# Altium project SSB25_rev0.PrjPCB
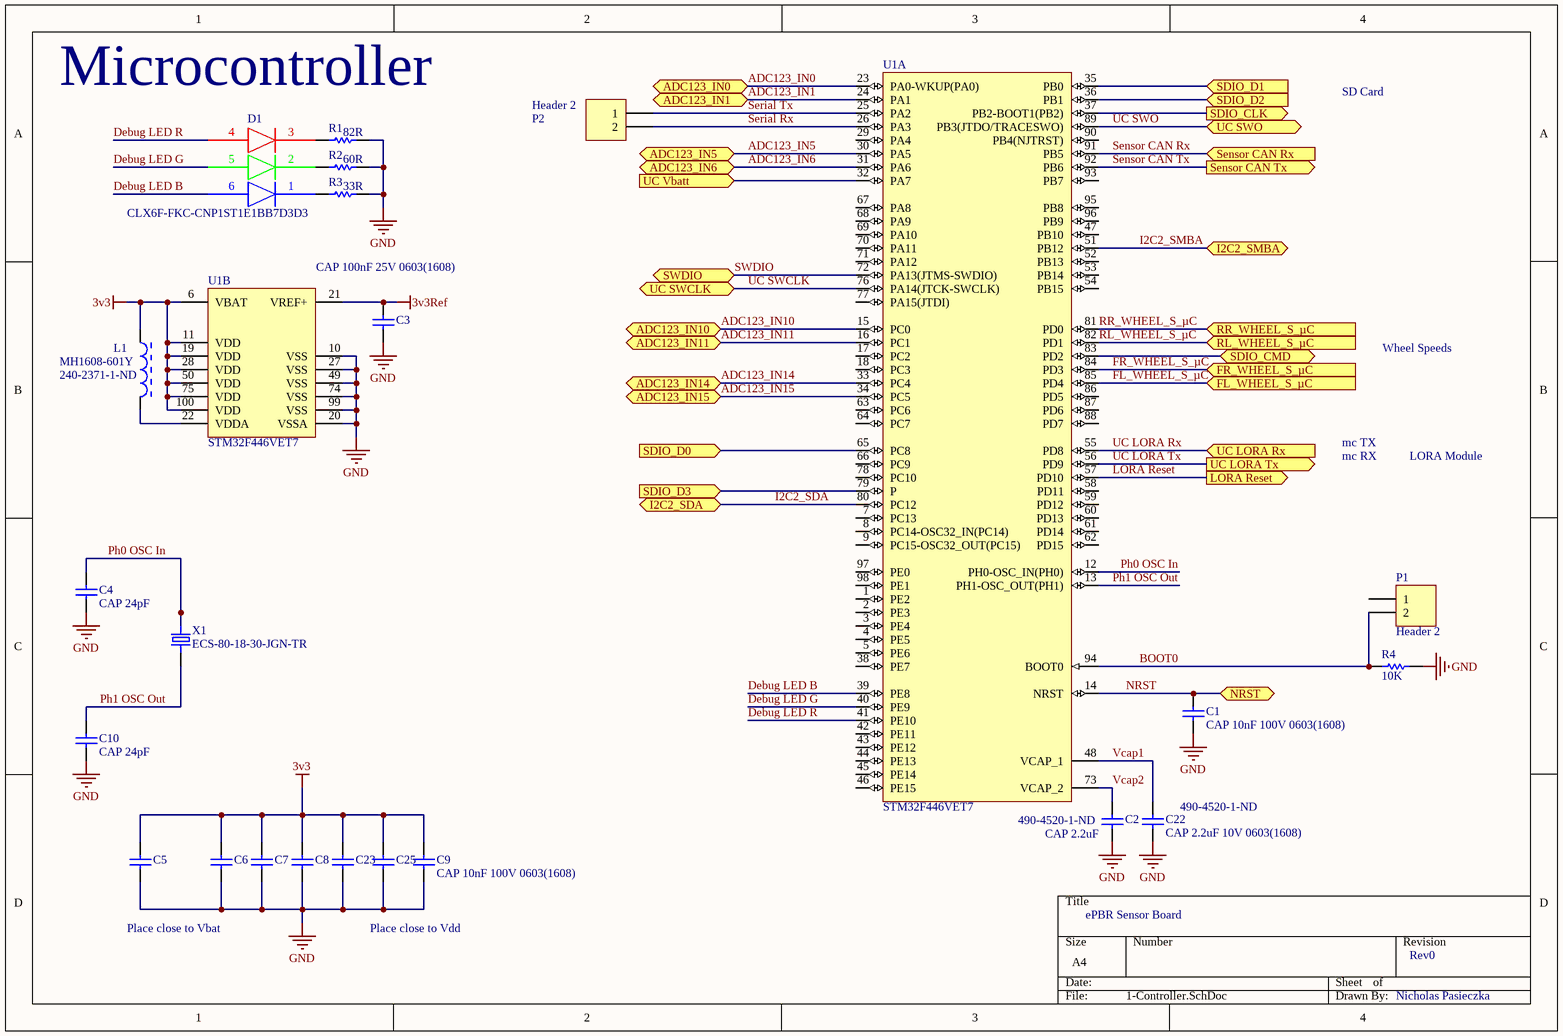
[diagram p0: 1-Controller.SchDoc]
4 sheets, 59 parts. Net scope: flat (ports and power ports of the same name join across sheets).
Board file: SSB25_rev0.PcbDoc
Sheets:
  1-Controller.SchDoc
  3-CAN.SchDoc
  4-Connector.SchDoc
  6-Sensors.SchDoc

## Sheet 1-Controller.SchDoc
size A4

### Parts
C1  CAP 10nF 100V 0603(1608)  [CAPC0603(1608)100_M]
C2  CAP 2.2uF  Supplier Part Number 1: 490-4520-1-ND  [CAPC0603(1608)55_N]
C3  CAP 100nF 25V 0603(1608)  [CAPC0603(1608)100_N]
C4  CAP 24pF  [CAPC0603(1608)100_N]
C5  CAP 10nF 100V 0603(1608)  [CAPC0603(1608)100_M]  (value not drawn)
C6  CAP 10nF 100V 0603(1608)  [CAPC0603(1608)100_M]  (value not drawn)
C7  CAP 10nF 100V 0603(1608)  [CAPC0603(1608)100_M]  (value not drawn)
C8  CAP 10nF 100V 0603(1608)  [CAPC0603(1608)100_M]  (value not drawn)
C9  CAP 10nF 100V 0603(1608)  [CAPC0603(1608)100_M]
C10  CAP 24pF  [CAPC0603(1608)100_N]
C22  CAP 2.2uF 10V 0603(1608)  Supplier Part Number 1: 490-4520-1-ND  [CAPC0603(1608)55_N]
C23  CAP 10nF 100V 0603(1608)  [CAPC0603(1608)100_M]  (value not drawn)
C25  CAP 10nF 100V 0603(1608)  [CAPC0603(1608)100_M]  (value not drawn)
D1  CLX6F-FKC-CNP1ST1E1BB7D3D3  [CLX6C-FKB]
L1  MH1608-601Y  Supplier Part Number 1: 240-2371-1-ND  [BOUR-MH1608_V]
P1  Header 2  [HDR1X2]
P2  Header 2  [HDR1X2]
R1  82R  [RESC0603(1608)_N]
R2  60R  [RESC0603(1608)_N]
R3  33R  [RESC0603(1608)_N]
R4  10K  [RESC0603(1608)_N]
U1  STM32F446VET7  [STM-LQFP100_L]  (parts A,B of 2)
X1  ECS-80-18-30-JGN-TR  [XTAL_ECS-80-18-30-JGN-TR]

### Ports
ADC123_IN0 (bidir), ADC123_IN1 (bidir), ADC123_IN5 (bidir), ADC123_IN6 (bidir), ADC123_IN10 (bidir), ADC123_IN11 (bidir), ADC123_IN14 (bidir), ADC123_IN15 (bidir), FL_WHEEL_S_µC (in), FR_WHEEL_S_µC (in), I2C2_SDA (bidir), I2C2_SMBA (bidir), LORA Reset (out), NRST (bidir), RL_WHEEL_S_µC (in), RR_WHEEL_S_µC (in), SDIO_CLK (out), SDIO_CMD (bidir), SDIO_D0 (in), SDIO_D1 (in), SDIO_D2 (in), SDIO_D3 (in), Sensor CAN Rx (in), Sensor CAN Tx (out), SWDIO (bidir), UC LORA Rx (in), UC LORA Tx (out), UC SWCLK (bidir), UC SWO (bidir), UC Vbatt (in)

### Nets
3v3: C5.2 C6.2 C7.2 C8.2 C9.2 C23.2 C25.2 L1.1 U1.6(VBAT) U1.11(VDD) U1.19(VDD) U1.28(VDD) U1.50(VDD) U1.75(VDD) U1.100(VDD)
3v3Ref: C3.2 U1.21(VREF+)
GND: C1.1 C2.1 C3.1 C4.1 C5.1 C6.1 C7.1 C8.1 C9.1 C10.1 C22.1 C23.1 C25.1 R1.2 R2.2 R3.2 R4.2 U1.10(VSS) U1.20(VSSA) U1.27(VSS) U1.49(VSS) U1.74(VSS) U1.99(VSS)
ADC123_IN0: U1.23(PA0-WKUP(PA0)) ; port ADC123_IN0
ADC123_IN1: U1.24(PA1) ; port ADC123_IN1
ADC123_IN5: U1.30(PA5) ; port ADC123_IN5
ADC123_IN6: U1.31(PA6) ; port ADC123_IN6
ADC123_IN10: U1.15(PC0) ; port ADC123_IN10
ADC123_IN11: U1.16(PC1) ; port ADC123_IN11
ADC123_IN14: U1.33(PC4) ; port ADC123_IN14
ADC123_IN15: U1.34(PC5) ; port ADC123_IN15
BOOT0: P1.2 R4.1 U1.94(BOOT0)
Debug LED B: D1.6(B) U1.39(PE8)
Debug LED G: D1.5(G) U1.40(PE9)
Debug LED R: D1.4(R) U1.41(PE10)
FL_WHEEL_S_µC: U1.85(PD4) ; port FL_WHEEL_S_µC
FR_WHEEL_S_µC: U1.84(PD3) ; port FR_WHEEL_S_µC
I2C2_SDA: U1.80(PC12) ; port I2C2_SDA
I2C2_SMBA: U1.51(PB12) ; port I2C2_SMBA
LORA Reset: U1.57(PD10) ; port LORA Reset
NRST: C1.2 U1.14(NRST) ; port NRST
Ph0 OSC In: C4.2 U1.12(PH0-OSC_IN(PH0)) X1.2(OUT/IN)
Ph1 OSC Out: C10.2 U1.13(PH1-OSC_OUT(PH1)) X1.1(IN/OUT)
RL_WHEEL_S_µC: U1.82(PD1) ; port RL_WHEEL_S_µC
RR_WHEEL_S_µC: U1.81(PD0) ; port RR_WHEEL_S_µC
Sensor CAN Rx: U1.91(PB5) ; port Sensor CAN Rx
Sensor CAN Tx: U1.92(PB6) ; port Sensor CAN Tx
Serial Rx: P2.2 U1.26(PA3)
Serial Tx: P2.1 U1.25(PA2)
SWDIO: U1.72(PA13(JTMS-SWDIO)) ; port SWDIO
UC LORA Rx: U1.55(PD8) ; port UC LORA Rx
UC LORA Tx: U1.56(PD9) ; port UC LORA Tx
UC SWCLK: U1.76(PA14(JTCK-SWCLK)) ; port UC SWCLK
UC SWO: U1.89(PB3(JTDO/TRACESWO)) ; port UC SWO
Vcap1: C22.2 U1.48(VCAP_1)
Vcap2: C2.2 U1.73(VCAP_2)
NetCN1_1: U1.83(PD2) ; port SDIO_CMD
NetCN1_2: U1.79(P) ; port SDIO_D3
NetCN1_3: U1.65(PC8) ; port SDIO_D0
NetCN1_4: U1.35(PB0) ; port SDIO_D1
NetCN1_5: U1.36(PB1) ; port SDIO_D2
NetCN1_6: U1.37(PB2-BOOT1(PB2)) ; port SDIO_CLK
NetD1_1: D1.1(B) R3.1
NetD1_2: D1.2(G) R2.1
NetD1_3: D1.3(R) R1.1
NetL1_2: L1.2 U1.22(VDDA)
NetU1_32: U1.32(PA7) ; port UC Vbatt

Not connected (* = marked no-connect by the designer): P1 1; U1 1(PE2) 2(PE3) 3(PE4) 4(PE5) 5(PE6) 7(PC13) 8(PC14-OSC32_IN(PC14)) 9(PC15-OSC32_OUT(PC15)) 17(PC2) 18(PC3) 29(PA4) 38(PE7) 42(PE11) 43(PE12) 44(PE13) 45(PE14) 46(PE15) 47(PB10) 52(PB13) 53(PB14) 54(PB15) 58(PD11) 59(PD12) 60(PD13) 61(PD14) 62(PD15) 63(PC6) 64(PC7) 66(PC9) 67(PA8) 68(PA9) 69(PA10) 70(PA11) 71(PA12) 77(PA15(JTDI)) 78(PC10) 86(PD5) 87(PD6) 88(PD7) 90(PB4(NJTRST)) 93(PB7) 95(PB8) 96(PB9) 97(PE0) 98(PE1)

### Notes on the sheet
- Microcontroller
- SD Card
- Wheel Speeds
- mc TX
- mc RX
- LORA Module
- ePBR Sensor Board
- Place close to Vbat
- Place close to Vdd
- Rev0
- Nicholas Pasieczka

### Library data of the parts
C1 C5-C9 C23 C25 = CMP-1035-02326-1: CAP 10nF 100V ±20% 0603 (1608 Metric) Thickness 1mm SMD; Case-EIA: 0603; Tolerance: Â±20%; Case-Metric: 1608; Max Thickness: 1 mm; Technology: SMT; Value: 10nF; Rated Voltage: 100 V
C2 C22 = CMP-1035-02757-1: CAP 2.2uF 10V ±10% 0603 (1608 Metric) Thickness 0.55mm SMD; Case-EIA: 0603; Case-Metric: 1608; Tolerance: Â±10%; Value: 2.2uF; Rated Voltage: 10 V; Technology: SMT; Max Thickness: 0.55 mm; Supplier 1: Digi-Key
C3 = CMP-1035-02589-1: CAP 100nF 25V ±20% 0603 (1608 Metric) Thickness 1mm SMD; Case-EIA: 0603; Tolerance: Â±20%; Case-Metric: 1608; Value: 100nF; Max Thickness: 1 mm; Technology: SMT; Rated Voltage: 25 V
C4 C10 = CMP-1035-00843-1: CAP 24pF 16V ±2% 0603 (1608 Metric) Thickness 1mm SMD; Tolerance: Â±2%; Case-Metric: 1608; Case-EIA: 0603; Value: 24pF; Technology: SMT; Rated Voltage: 16 V; Max Thickness: 1 mm
D1 = LED - CLX6F-FKC-CNP1ST1E1BB7D3D3: Red, Green, Blue (RGB) 622nm Red, 530nm Green, 470nm Blue LED Indication - Discrete 2.1V Red, 2.7V Green, 3V Blue 6-SMD, J-Lead; ComponentLink1Description: Digikey; ComponentLink1URL: https://www.digikey.ca/product-detail/en/cree-inc/CLX6F-FKC-CNP1ST1E1BB7D3D3/CLX6F-FKC-CNP1ST1E1BB7D3D3CT-ND/6362814
L1 = CMP-2000-06698-1: Chip Bead, 600 Ohm, 1 A, -55 to 125 degC, 2-Pin SMD (0603), RoHS, Tape and Reel; Manufacturer: Bourns; Impedance @ Frequency: 600Ohm@100MHz; Online Catalog: MHSeries; DC Resistance (DCR) (Max): 200mOhm; Current Rating (Max): 1A; Other Names: MH1608-601YCT; EDA / CAD Models: DownloadfromAcceleratedDesigns; Filter Type: Power,SignalLine; Number of Lines: 1; Mounting Type: SurfaceMount; Manufacturer URL: http://www.bourns.com/; Package Description: 2-Pin Surface Mount Device, Body 1.6 x 0.8 mm; Category: Filters; Packaging: CutTape(CT); Family: FerriteBeadsandChips; Datasheet Version: 03/2015; Standard Package: 1; Mounting Technology: SurfaceMount; Package / Case: 0603(1608Metric); Datasheet URL: http://www.bourns.com/docs/Product-Datasheets/mh.pdf; Operating Temperature: -55°C~125°C; RoHS Information: MH1608SeriesMaterialDeclaration; Ratings: -; Package Reference: 0603; Series: MH; Supplier 1: Digi-Key
P1 P2 = Header 2: Header, 2-Pin; LatestRevisionDate: 17-Jul-2002; LatestRevisionNote: Re-released for DXP Platform.; Publisher: Altium Limited
R1 = CMP-1012-00048-1: 82R 0.1W 5% 0603 (1608 Metric)  SMD; Case-Metric: 1608; Value: 82.00 Ohm; Case-EIA: 0603; Technology: SMT; Tolerance: 5 %; Power: 0.1 W
R2 = CMP-1012-00372-1: 60R4 0.1W 1% 0603 (1608 Metric)  SMD; Case-EIA: 0603; Value: 60.40 Ohm; Case-Metric: 1608; Technology: SMT; Tolerance: 1 %; Power: 0.1 W
R3 = CMP-1012-00038-1: 33R 0.1W 5% 0603 (1608 Metric)  SMD; Value: 33.00 Ohm; Case-EIA: 0603; Case-Metric: 1608; Tolerance: 5 %; Technology: SMT; Power: 0.1 W
R4 = CMP-1012-00098-1: 10K 0.1W 5% 0603 (1608 Metric)  SMD; Case-EIA: 0603; Value: 10000.00 Ohm; Case-Metric: 1608; Technology: SMT; Tolerance: 5 %; Power: 0.1 W
U1 = CMP-0243-00221-1: ARM Cortex-M4 32-bit MCU+FPU, 512 KB Flash, 128 KB Internal RAM, 81 I/Os, 100-Pin LQFP, -40 to 105 degC, Tray; Supply Voltage(Vcc) min (V): 1.7; Operating Frequency(F) (Processor speed) (MHz): 180; D/A Converter: 2; FLASH Size (Prog) (kB): 512; I/Os (High Current): 81; Internal RAM Size (kB): 128; Core: ARM Cortex-M4; Packing: Tray; ComponentLink1URL: http://www.st.com/; DatasheetVersion: Rev. 6; Mounting Technology: Surface Mount; ComponentLink2Description: Datasheet; ComponentLink2URL: http://www.st.com/st-web-ui/static/active/en/resource/technical/document/datasheet/DM00141306.pdf; Package Reference: 100-Pin Low Profile Quad Flat Package, Body 14 x 14 mm, Pitch 0.5 mm; ComponentLink1Description: Manufacturer URL; Package Description: LQFP100; PartId: 1
X1 = ECS-80-18-30-JGN-TR: 8MHz Â±20ppm Crystal 18pF 100 Ohms 2-SMD, No Lead; MF: ECS Inc.; Digi-Key_Part_Number: XC2103CT-ND; Digi-Key_Purchase_URL: https://www.digikey.com/product-detail/en/ecs-inc/ECS-80-18-30-JGN-TR/XC2103CT-ND/5875587?utm_source=snapeda&utm_medium=aggregator&utm_campaign=symbol; SnapEDA_Link: https://www.snapeda.com/parts/ECS-80-18-30-JGN-TR/ECS%20Inc./view-part/2121425/?ref=snap; Package: SMD-2 ECS International; MP: ECS-80-18-30-JGN-TR; Value: *

## Sheet 3-CAN.SchDoc
size A4
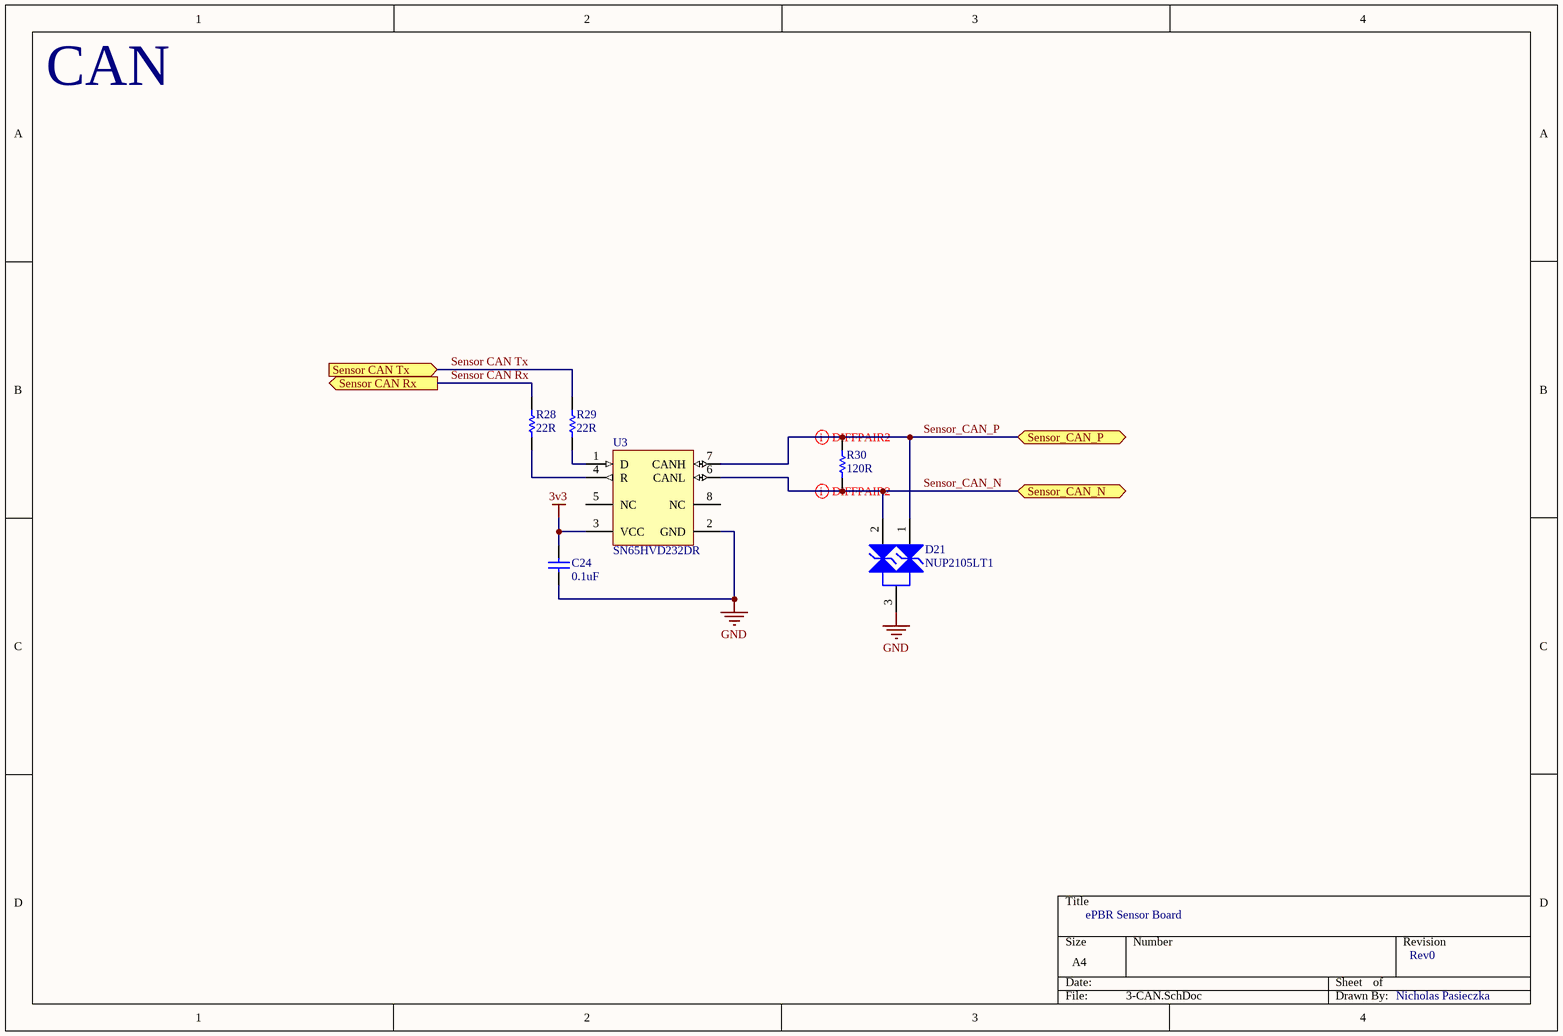
[diagram p1: 3-CAN.SchDoc]

### Parts
C24  0.1uF  [CAPC1608X90X30NL10T20]
D21  NUP2105LT1  [ONSC-SOT-23-3-318-08_V]
R28  22R  [RESC0603(1608)_N]
R29  22R  [RESC0603(1608)_N]
R30  120R  [RESC0603(1608)_N]
U3  SN65HVD232DR  [D0008A_M]

### Ports
Sensor CAN Rx (out), Sensor CAN Tx (in), Sensor_CAN_N (bidir), Sensor_CAN_P (bidir)

### Nets
3v3: C24.2 U3.3(VCC)
GND: C24.1 D21.3(K) U3.2(GND)
Sensor CAN Rx: R28.2 ; port Sensor CAN Rx
Sensor CAN Tx: R29.2 ; port Sensor CAN Tx
Sensor_CAN_N: D21.2(K) R30.1 U3.6(CANL) ; port Sensor_CAN_N
Sensor_CAN_P: D21.1(K) R30.2 U3.7(CANH) ; port Sensor_CAN_P
NetR28_1: R28.1 U3.4(R)
NetR29_1: R29.1 U3.1(D)

Not connected (* = marked no-connect by the designer): U3 5(NC) 8(NC)

### Layout directives
differential pair: Sensor_CAN_N, Sensor_CAN_P

### Notes on the sheet
- CAN
- ePBR Sensor Board
- Rev0
- Nicholas Pasieczka

### Library data of the parts
C24 = CMP-2000-06092-1: Chip Capacitor, 100 nF, +/- 10%, 50 V, -55 to 125 degC, 0603 (1608 Metric), RoHS, Tape and Reel; Manufacturer: SamsungElectro-Mechanics; Product Length: 1.6mm; Voltage: 50Vdc; Product Height: 0.8mm; Rad Hard: No; Dielectric: X7R; Packaging: Tape&Reel; Package Description: 2-Pin Surface Mount Device, Body 1.60 x 0.80 mm; Package Reference: 0603; Datasheet Version: 06/2016; Operating Temperature: -55to125°C; Category: CapacitorCeramicMultilayer; Product Depth: 0.8mm; Mounting Technology: SurfaceMount; Package/Case: 0603; Capacitance Value: 0.1uF; Tolerance: 10%; Manufacturer URL: http://www.samsungsem.com/global/index.jsp; Construction: Flat; Mounting: SurfaceMount; Datasheet URL: http://www.samsungsem.com/kr/support/product-search/mlcc/__icsFiles/afieldfile/2016/08/18/S_CL10B104KB8SFNC.pdf
D21 = CMP-1063-00165-1: Dual Line CAN Bus Protector, 3-Pin SOT-23, Tape and Reel; Manufacturer: On Semiconductor; PPK Max (W): 350; IR Max (uA): 0.1; Number of Lines: 2; V(BR) Min (V): 26.2; Direction: Bidirectional; C Max (pF): 30; PackageDescription: 3-Pin Small Outline Transistor, Body 2.92 x 1.3 mm, Pitch 0.95 mm; ComponentLink2URL: http://www.onsemi.cn/pub_link/Collateral/NUP2105L-D.PDF; ComponentLink3Description: Package Specification; ComponentLink2Description: Datasheet; ComponentLink1URL: http://www.onsemi.com/; Mounting Technology: Surface Mount; ComponentLink1Description: Manufacturer URL; Packing: Tape and Reel; PackageVersion: Rev. AP, 11/2009; PartNumber: NUP2105LT1; DatasheetVersion: Rev. 5; ComponentLink3URL: http://www.onsemi.cn/pub_link/Collateral/318-08.PDF; PackageReference: SOT-23-3-318-08
R28 R29 = CMP-1012-00034-1: 22R 0.1W 5% 0603 (1608 Metric)  SMD; Value: 22.00 Ohm; Case-EIA: 0603; Case-Metric: 1608; Technology: SMT; Power: 0.1 W; Tolerance: 5 %
R30 = CMP-1012-00052-1: 120R 0.1W 5% 0603 (1608 Metric)  SMD; Case-EIA: 0603; Value: 120.00 Ohm; Case-Metric: 1608; Technology: SMT; Power: 0.1 W; Tolerance: 5 %
U3 = CMP-0315-00075-2: 3.3 V Can Transceiver, 17 mA, -40 to 85 degC, 8-pin SOIC (D), Green (RoHS & no Sb/Br); Manufacturer: Texas Instruments; Supply Voltage(s)(V): 3.3; Receivers Per Package: 1; ICC(Max)(mA): 17; Rating: Catalog; Transient Pulse Protection(V): -25 to 25; Mounting Technology: Surface Mount; PartNumber: SN65HVD232DR; Code_JEDEC: MS-012AA; Eco-Plan: Green (RoHS & no Sb/Br); Isolated: No; SubFamily: CAN; Footprint: SN65HVD232; Drivers Per Package: 1; ComponentLink1URL: http://www.ti.com/general/docs/lit/getliterature.tsp?genericPartNumber=SN65HVD232&fileType=pdf; ComponentLink1Description: Datasheet; PackageDescription: 8-Pin Plastic Small Outline Integrated Circuit, 4.9 x 3.9 mm, Pitch 1.27 mm Pitch; PackageReference: D0008A; DatasheetVersion: SLOS346K; PackageVersion: revM, Jun-2011

## Sheet 4-Connector.SchDoc
size A4
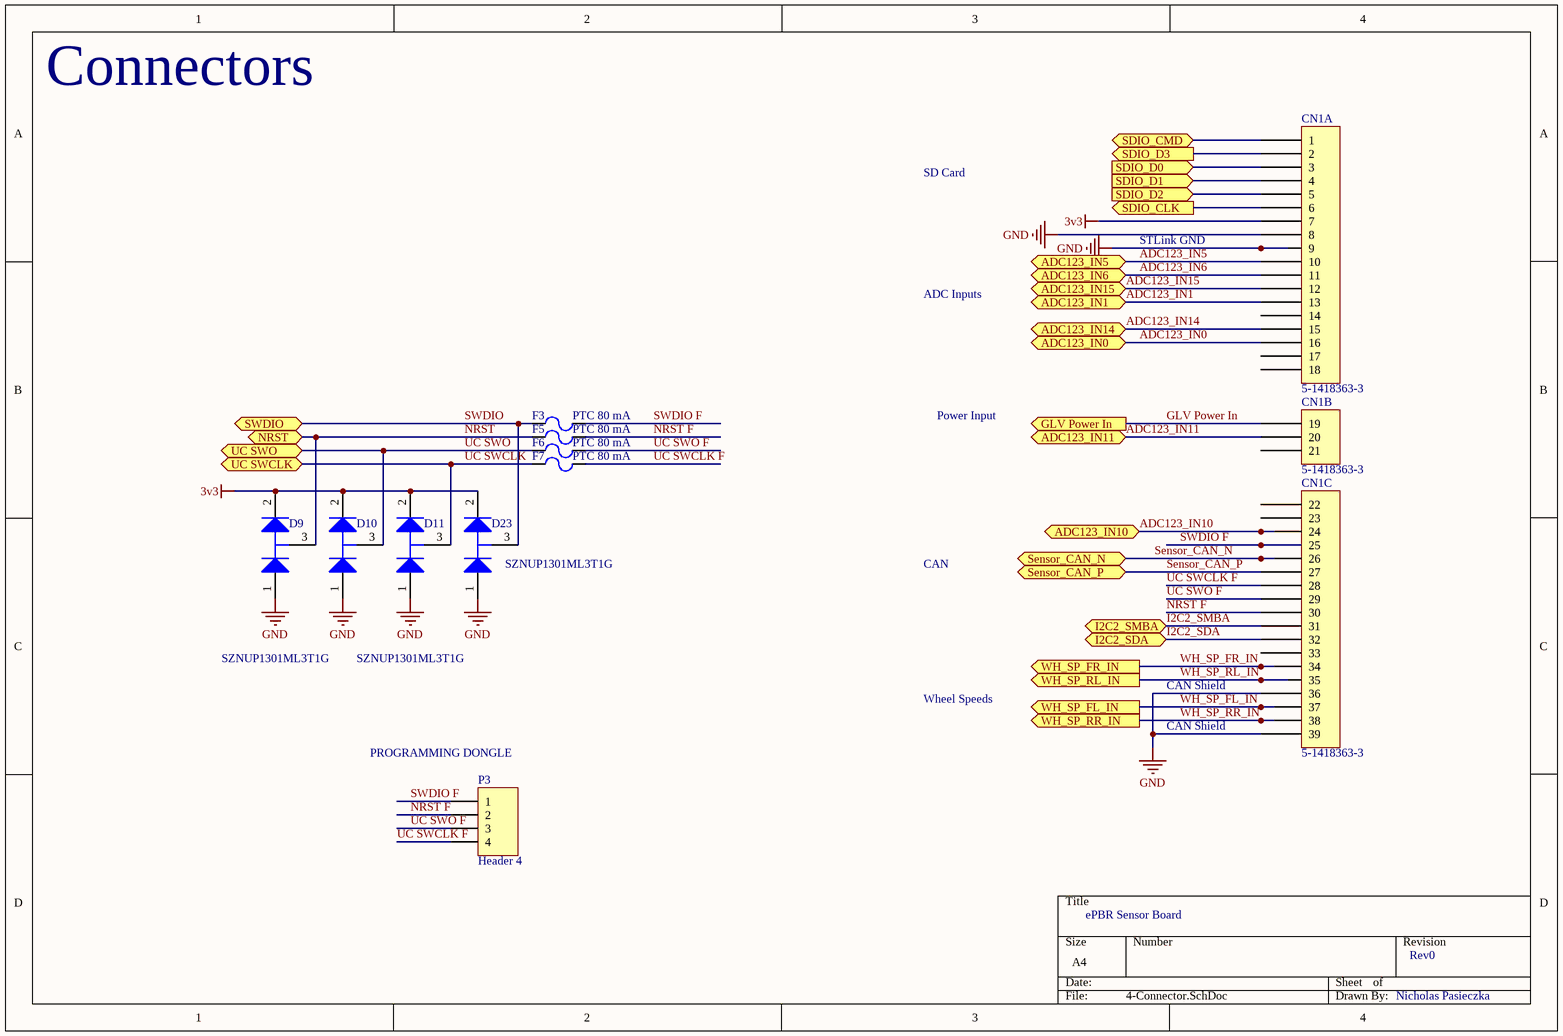
[diagram p2: 4-Connector.SchDoc]

### Parts
CN1  5-1418363-3  [5-1418363-3]  (parts A,B,C of 3)
D9  SZNUP1301ML3T1G  [ONSC-SOT-23-3-318-08_V]
D10  SZNUP1301ML3T1G  [ONSC-SOT-23-3-318-08_V]  (value not drawn)
D11  SZNUP1301ML3T1G  [ONSC-SOT-23-3-318-08_V]
D23  SZNUP1301ML3T1G  [ONSC-SOT-23-3-318-08_V]
F3  PTC 80 mA  [0603 fuse]
F5  PTC 80 mA  [0603 fuse]
F6  PTC 80 mA  [0603 fuse]
F7  PTC 80 mA  [0603 fuse]
P3  Header 4  [HDR1X4]

### Ports
ADC123_IN0 (bidir), ADC123_IN1 (bidir), ADC123_IN5 (bidir), ADC123_IN6 (bidir), ADC123_IN10 (bidir), ADC123_IN11 (bidir), ADC123_IN14 (bidir), ADC123_IN15 (bidir), GLV Power In (out), I2C2_SDA (bidir), I2C2_SMBA (bidir), NRST (bidir), SDIO_CLK (out), SDIO_CMD (bidir), SDIO_D0 (in), SDIO_D1 (in), SDIO_D2 (in), SDIO_D3 (out), Sensor_CAN_N (bidir), Sensor_CAN_P (bidir), SWDIO (bidir), UC SWCLK (bidir), UC SWO (bidir), WH_SP_FL_IN (out), WH_SP_FR_IN (out), WH_SP_RL_IN (out), WH_SP_RR_IN (out)

### Nets
3v3: CN1.7 D9.2(K) D10.2(K) D11.2(K) D23.2(K)
GND: CN1.8 CN1.9 CN1.36 CN1.39 D9.1(A) D10.1(A) D11.1(A) D23.1(A)
ADC123_IN0: CN1.16 ; port ADC123_IN0
ADC123_IN1: CN1.13 ; port ADC123_IN1
ADC123_IN5: CN1.10 ; port ADC123_IN5
ADC123_IN6: CN1.11 ; port ADC123_IN6
ADC123_IN10: CN1.24 ; port ADC123_IN10
ADC123_IN11: CN1.20 ; port ADC123_IN11
ADC123_IN14: CN1.15 ; port ADC123_IN14
ADC123_IN15: CN1.12 ; port ADC123_IN15
GLV Power In: CN1.19 ; port GLV Power In
I2C2_SDA: CN1.32 ; port I2C2_SDA
I2C2_SMBA: CN1.31 ; port I2C2_SMBA
NRST: D9.3(K/A) F5.1 ; port NRST
NRST F: CN1.30 F5.2 P3.2
Sensor_CAN_N: CN1.26 ; port Sensor_CAN_N
Sensor_CAN_P: CN1.27 ; port Sensor_CAN_P
SWDIO: D23.3(K/A) F3.1 ; port SWDIO
SWDIO F: CN1.25 F3.2 P3.1
UC SWCLK: D11.3(K/A) F7.1 ; port UC SWCLK
UC SWCLK F: CN1.28 F7.2 P3.4
UC SWO: D10.3(K/A) F6.1 ; port UC SWO
UC SWO F: CN1.29 F6.2 P3.3
WH_SP_FL_IN: CN1.37 ; port WH_SP_FL_IN
WH_SP_FR_IN: CN1.34 ; port WH_SP_FR_IN
WH_SP_RL_IN: CN1.35 ; port WH_SP_RL_IN
WH_SP_RR_IN: CN1.38 ; port WH_SP_RR_IN
NetCN1_1: CN1.1 ; port SDIO_CMD
NetCN1_2: CN1.2 ; port SDIO_D3
NetCN1_3: CN1.3 ; port SDIO_D0
NetCN1_4: CN1.4 ; port SDIO_D1
NetCN1_5: CN1.5 ; port SDIO_D2
NetCN1_6: CN1.6 ; port SDIO_CLK

Not connected (* = marked no-connect by the designer): CN1 14 17 18 21 22 23 33

### Notes on the sheet
- Connectors
- SD Card
- STLink GND
- ADC Inputs
- Power Input
- CAN
- Wheel Speeds
- CAN Shield
- (near P3) PROGRAMMING DONGLE
- ePBR Sensor Board
- Rev0
- Nicholas Pasieczka

### Library data of the parts
CN1 = 5-1418363-3: Levyseal 90 degree 39 pin header
D9-D11 D23 = CMP-1063-00171-1: Low Capacitance Diode Array for ESD Protection in a Single Data Line, 3-Pin SOT-23, Pb-Free, Tape and Reel; Manufacturer: On Semiconductor; C Max (pF): 0.9; Direction: Bidirectional; V(BR) Min (V): 70; Number of Lines: 1; Mounting Technology: Surface Mount; PackageReference: SOT-23-3-318-08; DatasheetVersion: Rev. 6; PackageVersion: Rev. AP, 11/2009; RoHS: Pb-Free; ComponentLink1Description: Manufacturer URL; ComponentLink1URL: http://www.onsemi.com/; PackageDescription: 3-Pin Small Outline Transistor, Body 2.92 x 1.3 mm, Pitch 0.95 mm; PartNumber: SZNUP1301ML3T1G; Packing: Tape and Reel; ComponentLink3URL: http://www.onsemi.cn/pub_link/Collateral/318-08.PDF; ComponentLink3Description: Package Specification; VRWM Max (V): 70; ComponentLink2Description: Datasheet; ComponentLink2URL: http://www.onsemi.cn/pub_link/Collateral/NUP1301ML3T1-D.PDF; Supplier 1: Mouser; Supplier Part Number 1: 863-SZNUP1301ML3T1G
F3 F5-F7 = PTC fuse 80mA 0ZCM0008FF2G: 0ZCM0008FF2G; Supplier 1: Digi-Key; Supplier Part Number 1: 507-1817-1-ND
P3 = Header 4: Header, 4-Pin; LatestRevisionDate: 17-Jul-2002; LatestRevisionNote: Re-released for DXP Platform.; Publisher: Altium Limited

## Sheet 6-Sensors.SchDoc
size A4
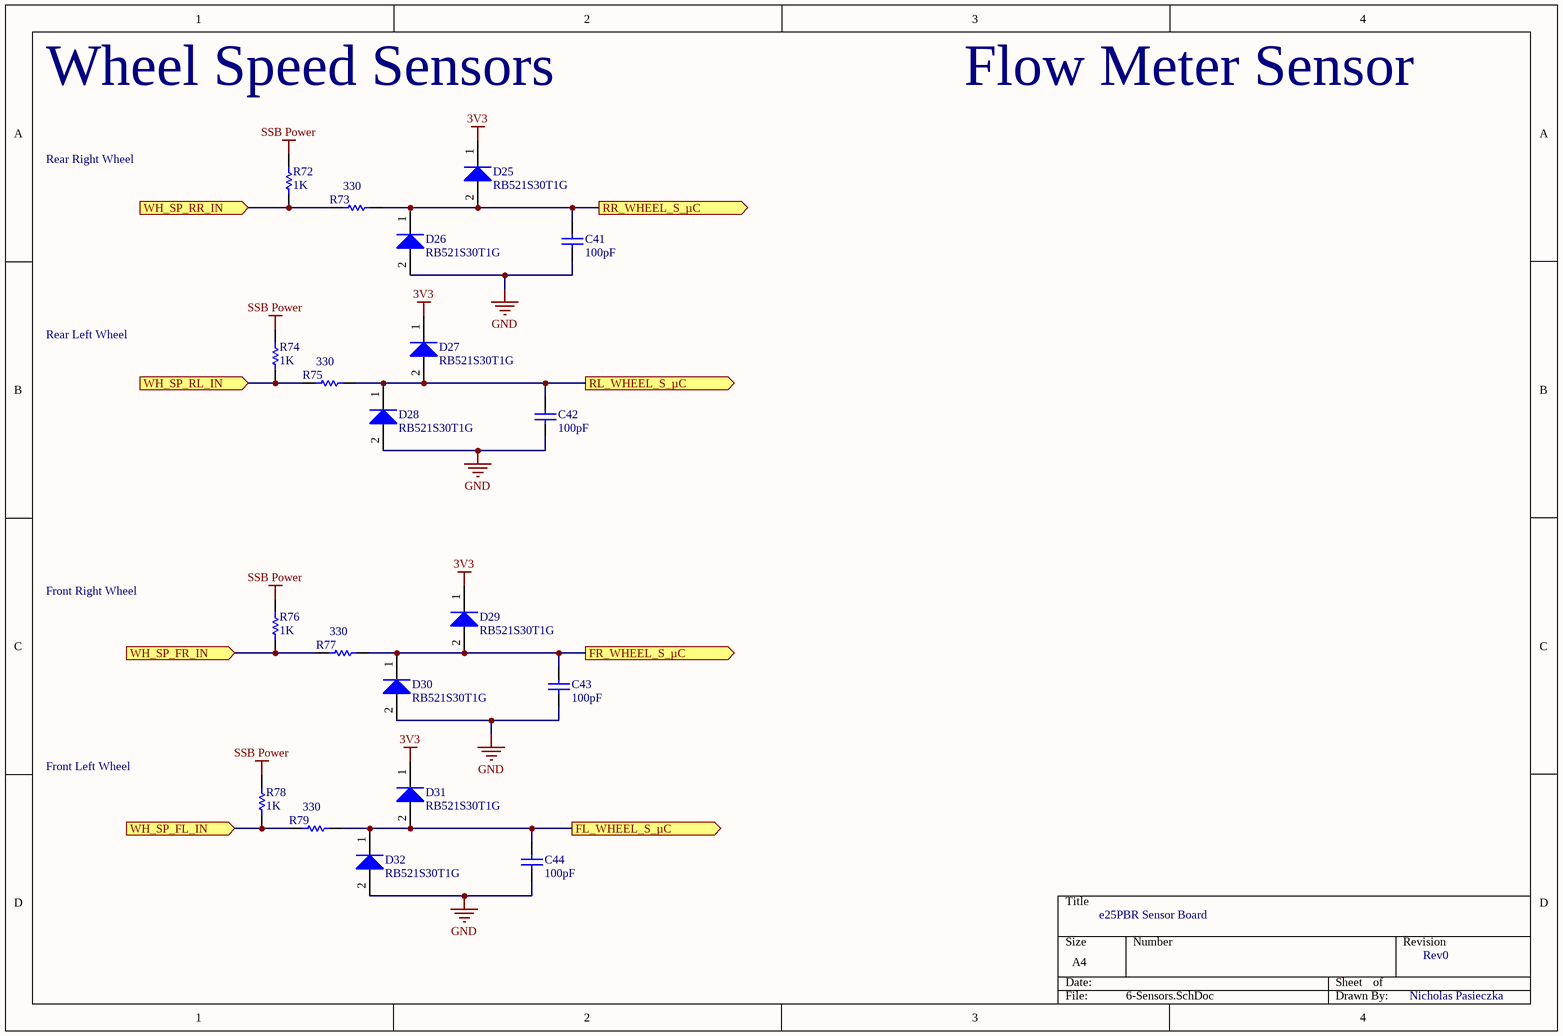
[diagram p3: 6-Sensors.SchDoc]

### Parts
C41  value 100pF  [1608[0603]]  (hidden comment: Cap)
C42  value 100pF  [1608[0603]]  (hidden comment: Cap)
C43  value 100pF  [1608[0603]]  (hidden comment: Cap)
C44  value 100pF  [1608[0603]]  (hidden comment: Cap)
D25  RB521S30T1G  [ONSC-SOD-523-2-502-01_V]
D26  RB521S30T1G  [ONSC-SOD-523-2-502-01_V]
D27  RB521S30T1G  [ONSC-SOD-523-2-502-01_V]
D28  RB521S30T1G  [ONSC-SOD-523-2-502-01_V]
D29  RB521S30T1G  [ONSC-SOD-523-2-502-01_V]
D30  RB521S30T1G  [ONSC-SOD-523-2-502-01_V]
D31  RB521S30T1G  [ONSC-SOD-523-2-502-01_V]
D32  RB521S30T1G  [ONSC-SOD-523-2-502-01_V]
R72  value 1K  [1608[0603]]  (hidden comment: Res1)
R73  value 330  [1608[0603]]  (hidden comment: Res1)
R74  value 1K  [1608[0603]]  (hidden comment: Res1)
R75  value 330  [1608[0603]]  (hidden comment: Res1)
R76  value 1K  [1608[0603]]  (hidden comment: Res1)
R77  value 330  [1608[0603]]  (hidden comment: Res1)
R78  value 1K  [1608[0603]]  (hidden comment: Res1)
R79  value 330  [1608[0603]]  (hidden comment: Res1)

### Ports
FL_WHEEL_S_µC (out), FR_WHEEL_S_µC (out), RL_WHEEL_S_µC (out), RR_WHEEL_S_µC (out), WH_SP_FL_IN (in), WH_SP_FR_IN (in), WH_SP_RL_IN (in), WH_SP_RR_IN (in)

### Nets
3v3: D25.1(K) D27.1(K) D29.1(K) D31.1(K)
GND: C41.1 C42.1 C43.1 C44.1 D26.2(A) D28.2(A) D30.2(A) D32.2(A)
SSB Power: R72.2 R74.2 R76.2 R78.2
FL_WHEEL_S_µC: C44.2 D31.2(A) D32.1(K) R79.2 ; port FL_WHEEL_S_µC
FR_WHEEL_S_µC: C43.2 D29.2(A) D30.1(K) R77.2 ; port FR_WHEEL_S_µC
RL_WHEEL_S_µC: C42.2 D27.2(A) D28.1(K) R75.2 ; port RL_WHEEL_S_µC
RR_WHEEL_S_µC: C41.2 D25.2(A) D26.1(K) R73.2 ; port RR_WHEEL_S_µC
WH_SP_FL_IN: R78.1 R79.1 ; port WH_SP_FL_IN
WH_SP_FR_IN: R76.1 R77.1 ; port WH_SP_FR_IN
WH_SP_RL_IN: R74.1 R75.1 ; port WH_SP_RL_IN
WH_SP_RR_IN: R72.1 R73.1 ; port WH_SP_RR_IN

### Notes on the sheet
- Wheel Speed Sensors
- Flow Meter Sensor
- Rear Right Wheel
- Rear Left Wheel
- Front Right Wheel
- Front Left Wheel
- e25PBR Sensor Board
- Rev0
- Nicholas Pasieczka

### Library data of the parts
C41-C44 = Cap: Capacitor; Published: 8-Jun-2000; LatestRevisionDate: 17-Jul-2002; LatestRevisionNote: Re-released for DXP Platform.; PackageReference: RAD-0.3; Publisher: Altium Limited; PackageDescription: Radial Cap, Thru-Hole; 2 Leads; 0.3 in Pin Spacing
D25-D32 = CMP-1051-00018-1: Schottky Barrier Diode, 2-Pin SOD-523, Pb-Free, Tape and Reel; Manufacturer: On Semiconductor; Configuration: Single; IFSM Max (A): 1; Mounting Technology: Surface Mount; ComponentLink1Description: Manufacturer URL; PackageReference: SOD-523-2-502-01; RoHS: TRUE; ComponentLink3Description: Package Specification; ComponentLink2Description: Datasheet; PackageVersion: Rev. E, 09/2010; PartNumber: RB521S30T1G; ComponentLink3URL: http://www.onsemi.com/pub_link/Collateral/502-01.PDF; ComponentLink1URL: http://www.onsemi.com/; PackageDescription: 2-Pin SOD, Body 1.2 x 0.8 mm; DatasheetVersion: Rev. 8; ComponentLink2URL: http://www.onsemi.cn/pub_link/Collateral/RB521S30T1-D.PDF; Packing: Tape and Reel
R72-R79 = Res1: Resistor; Published: 8-Jun-2000; LatestRevisionDate: 17-Jul-2002; LatestRevisionNote: Re-released for DXP Platform.; PackageReference: AXIAL-0.3; Publisher: Altium Limited; PackageDescription: Axial Device, Thru-Hole; 2 Leads; 0.3 in Pin Spacing

## Nets that join several sheets
3v3: 1-Controller (15 pins), 3-CAN (C24.2 U3.3), 4-Connector (5 pins), 6-Sensors (D25.1 D27.1 D29.1 D31.1)
GND: 1-Controller (23 pins), 3-CAN (C24.1 D21.3 U3.2), 4-Connector (8 pins), 6-Sensors (8 pins)
ADC123_IN0: 1-Controller (U1.23), 4-Connector (CN1.16)
ADC123_IN1: 1-Controller (U1.24), 4-Connector (CN1.13)
ADC123_IN5: 1-Controller (U1.30), 4-Connector (CN1.10)
ADC123_IN6: 1-Controller (U1.31), 4-Connector (CN1.11)
ADC123_IN10: 1-Controller (U1.15), 4-Connector (CN1.24)
ADC123_IN11: 1-Controller (U1.16), 4-Connector (CN1.20)
ADC123_IN14: 1-Controller (U1.33), 4-Connector (CN1.15)
ADC123_IN15: 1-Controller (U1.34), 4-Connector (CN1.12)
FL_WHEEL_S_µC: 1-Controller (U1.85), 6-Sensors (C44.2 D31.2 D32.1 R79.2)
FR_WHEEL_S_µC: 1-Controller (U1.84), 6-Sensors (C43.2 D29.2 D30.1 R77.2)
I2C2_SDA: 1-Controller (U1.80), 4-Connector (CN1.32)
I2C2_SMBA: 1-Controller (U1.51), 4-Connector (CN1.31)
NetCN1_1: 1-Controller (U1.83), 4-Connector (CN1.1)
NetCN1_2: 1-Controller (U1.79), 4-Connector (CN1.2)
NetCN1_3: 1-Controller (U1.65), 4-Connector (CN1.3)
NetCN1_4: 1-Controller (U1.35), 4-Connector (CN1.4)
NetCN1_5: 1-Controller (U1.36), 4-Connector (CN1.5)
NetCN1_6: 1-Controller (U1.37), 4-Connector (CN1.6)
NRST: 1-Controller (C1.2 U1.14), 4-Connector (D9.3 F5.1)
RL_WHEEL_S_µC: 1-Controller (U1.82), 6-Sensors (C42.2 D27.2 D28.1 R75.2)
RR_WHEEL_S_µC: 1-Controller (U1.81), 6-Sensors (C41.2 D25.2 D26.1 R73.2)
Sensor CAN Rx: 1-Controller (U1.91), 3-CAN (R28.2)
Sensor CAN Tx: 1-Controller (U1.92), 3-CAN (R29.2)
Sensor_CAN_N: 3-CAN (D21.2 R30.1 U3.6), 4-Connector (CN1.26)
Sensor_CAN_P: 3-CAN (D21.1 R30.2 U3.7), 4-Connector (CN1.27)
SWDIO: 1-Controller (U1.72), 4-Connector (D23.3 F3.1)
UC SWCLK: 1-Controller (U1.76), 4-Connector (D11.3 F7.1)
UC SWO: 1-Controller (U1.89), 4-Connector (D10.3 F6.1)
WH_SP_FL_IN: 4-Connector (CN1.37), 6-Sensors (R78.1 R79.1)
WH_SP_FR_IN: 4-Connector (CN1.34), 6-Sensors (R76.1 R77.1)
WH_SP_RL_IN: 4-Connector (CN1.35), 6-Sensors (R74.1 R75.1)
WH_SP_RR_IN: 4-Connector (CN1.38), 6-Sensors (R72.1 R73.1)